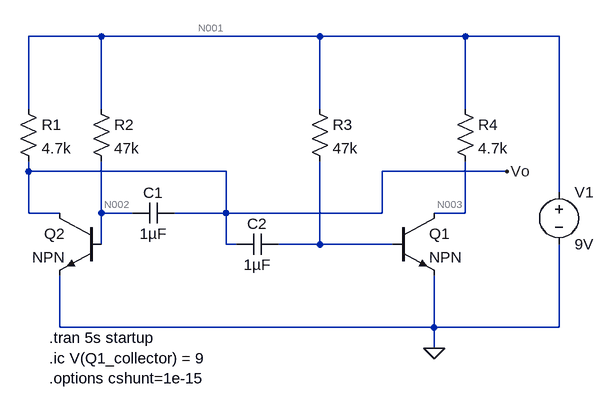
[diagram p0: schematic Draft3.asc]
Draft3.asc, the LTspice schematic file:
Version 4
SHEET 1 904 680
WIRE 144 -64 32 -64
WIRE 480 -64 144 -64
WIRE 704 -64 480 -64
WIRE 848 -64 704 -64
WIRE 32 48 32 -64
WIRE 144 48 144 -64
WIRE 480 48 480 -64
WIRE 704 48 704 -64
WIRE 32 144 32 128
WIRE 336 144 32 144
WIRE 768 144 576 144
WIRE 848 176 848 -64
WIRE 32 208 32 144
WIRE 80 208 32 208
WIRE 144 208 144 128
WIRE 192 208 144 208
WIRE 336 208 336 144
WIRE 336 208 256 208
WIRE 576 208 576 144
WIRE 576 208 336 208
WIRE 704 208 704 128
WIRE 704 208 656 208
WIRE 144 256 144 208
WIRE 336 256 336 208
WIRE 352 256 336 256
WIRE 480 256 480 128
WIRE 480 256 416 256
WIRE 592 256 480 256
WIRE 80 384 80 304
WIRE 656 384 656 304
WIRE 656 384 80 384
WIRE 848 384 848 256
WIRE 848 384 656 384
WIRE 656 416 656 384
FLAG 768 144 Vo
FLAG 656 416 0
SYMBOL res 16 32 R0
SYMATTR InstName R1
SYMATTR Value 4.7k
SYMBOL res 128 32 R0
SYMATTR InstName R2
SYMATTR Value 47k
SYMBOL res 464 32 R0
SYMATTR InstName R3
SYMATTR Value 47k
SYMBOL res 688 32 R0
SYMATTR InstName R4
SYMATTR Value 4.7k
SYMBOL npn 592 208 R0
SYMATTR InstName Q1
SYMBOL npn 144 208 M0
SYMATTR InstName Q2
SYMBOL cap 256 192 R90
WINDOW 0 0 32 VBottom 2
WINDOW 3 32 32 VTop 2
SYMATTR InstName C1
SYMATTR Value 1µF
SYMBOL cap 416 240 R90
WINDOW 0 0 32 VBottom 2
WINDOW 3 32 32 VTop 2
SYMATTR InstName C2
SYMATTR Value 1µF
SYMBOL voltage 848 160 R0
WINDOW 123 0 0 Left 0
WINDOW 39 0 0 Left 0
SYMATTR InstName V1
SYMATTR Value 9V
TEXT 64 400 Left 2 !.tran 5s startup\n.ic V(Q1_collector) = 9\n.options cshunt=1e-15

The netlist it stands for:
* Draft3.asc
R1 N001 Vo 4.7k
R2 N001 N002 47k
R3 N001 N004 47k
R4 N001 N003 4.7k
Q1 N003 N004 0 0 NPN
Q2 Vo N002 0 0 NPN
C1 Vo N002 1µF
C2 N004 Vo 1µF
V1 N001 0 9V
.model NPN NPN
.model PNP PNP
.lib standard.bjt
.tran 5s startup
.ic V(Q1_collector) = 9
.options cshunt=1e-15
.backanno
.end

* Results of the author's LTspice run, read from the files saved beside the schematic
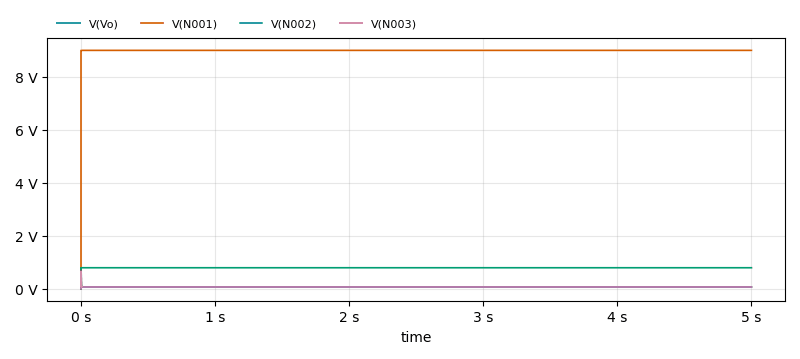
[diagram p1: Transient Analysis of Draft3.asc, plotted from the saved traces]
* Transient Analysis, 1 run:
*   V(Vo): min 0 V, max 790.9 mV, average 69.46 mV, rms 70.73 mV, last 69.09 mV
*   V(N001): min 0 V, max 9 V, average 9 V, rms 9 V, last 9 V
*   V(N002): min 0 V, max 794.7 mV, average 794.7 mV, rms 794.7 mV, last 794.7 mV
*   V(N003): min 0 V, max 660.3 mV, average 69.18 mV, rms 69.23 mV, last 69.09 mV